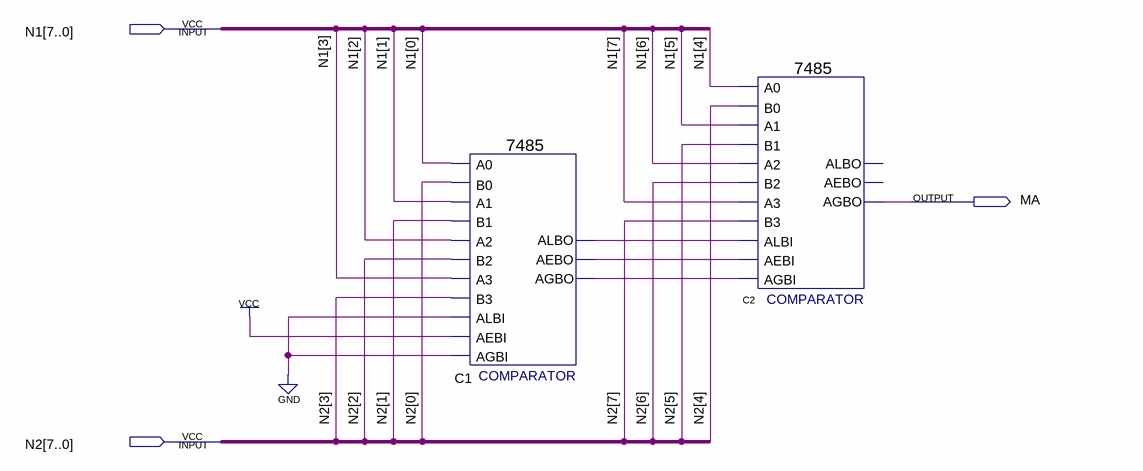
[diagram p0: schematic sheet]
// Quartus schematic comparador.bdf as structural Verilog: 2 symbols, 3 pins
module comparador (
  input  [7:0] N1,
  input  [7:0] N2,
  output MA
);

  wire C1_aebo, C1_agbo, C1_albo;

  \7485  C1 (
    .A3(N1[3]), .B2(N2[2]), .A2(N1[2]), .AEBI(1'b1), .AGBI(1'b0), .ALBI(1'b0), .A0(N1[0]), .B0(N2[0]),
    .B3(N2[3]), .A1(N1[1]), .B1(N2[1]), .ALBO(C1_albo), .AGBO(C1_agbo), .AEBO(C1_aebo));
  \7485  C2 (
    .A3(N1[7]), .B2(N2[6]), .A2(N1[6]), .AEBI(C1_aebo), .AGBI(C1_agbo), .ALBI(C1_albo), .A0(N1[4]),
    .B0(N2[4]), .B3(N2[7]), .A1(N1[5]), .B1(N2[5]), .AGBO(MA));  // open: ALBO, AEBO
endmodule
